# Altium project USBC2USB.PrjPcb
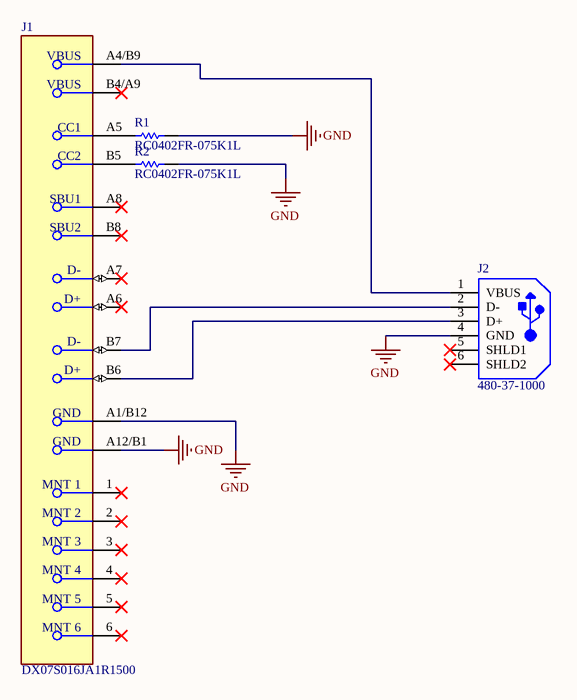
[diagram p0: USB2USB.SchDoc]
1 sheet, 4 parts. Net scope: global (net labels, ports and power ports of the same name join across sheets).
Board file: USB2USB.PcbDoc

## Sheet USB2USB.SchDoc
size A2; SheetNumber: 1; SheetTotal: 1

### Parts
J1  DX07S016JA1R1500  [FP-DX07S016JA1R1500-MFG]
J2  480-37-1000  [MOLX-480-37-1000_V]
R1  RC0402FR-075K1L  [RESC1005X40X25NL05T10]
R2  RC0402FR-075K1L  [RESC1005X40X25NL05T10]

### Nets
GND: J1.A1/B12(GND) J1.A12/B1(GND) J2.4(GND) R1.2 R2.2
NetJ1_A4/B9: J1.A4/B9(VBUS) J2.1(VBUS)
NetJ1_A5: J1.A5(CC1) R1.1
NetJ1_B5: J1.B5(CC2) R2.1
NetJ1_B6: J1.B6(D+) J2.3(D+)
NetJ1_B7: J1.B7(D-) J2.2(D-)

Not connected (* = marked no-connect by the designer): J1 1(MNT_1)* 2(MNT_2)* 3(MNT_3)* 4(MNT_4)* 5(MNT_5)* 6(MNT_6)* A6(D+)* A7(D-)* A8(SBU1)* B4/A9(VBUS)* B8(SBU2)*; J2 5(SHLD1)* 6(SHLD2)*

### Library data of the parts
J1 = CMP-19038-000003-1: CONN RCP USB2.0 TYP C 24P SMD RA
J2 = CMP-1676-00005-2: Universal Serial Bus (USB) Shielded I/O Plug, Type A, Right Angle Connector, 1.5 A, -20 to 85 degC, 4-Pin SMD, RoHS, Tray; Voltage Rating (DC): 50 V; Tolerance: 1%; Resistance: 1 mohm; Power Rating: 100 mW; Case\Package: 0603; PackageDescription: 4-Pin Surface Mount Device, Body 12 x 18.8 mm; Max Operating Temperature: 155 degC; PackageReference: 480-37-1000; ComponentLink2Description: Datasheet; ComponentLink1Description: Manufacturer URL; Packaging: Tape and Reel; REACH SVHC: No SVHC; Width: 0.8 mm; Case Code (Imperial): 0603; Pins: 2; Length: 1.6 mm; DatasheetVersion: Rev. D, 06/2004; Voltage Rating: 50 V; ComponentLink1URL: http://www.molex.com/; Mount: Surface Mount; Case Code (Metric): 1608; ComponentLink2URL: http://www.molex.com/pdm_docs/sd/480371000_sd.pdf; RoHSCompliant: true; Min Operating Temperature: -55 degC; Package Quantity: 5000; Height: 0.45 mm
R1 R2 = CMP-2002-07753-1: Manufacturer: Yageo / Phycomp; Part Number: RC0402FR-075K1L